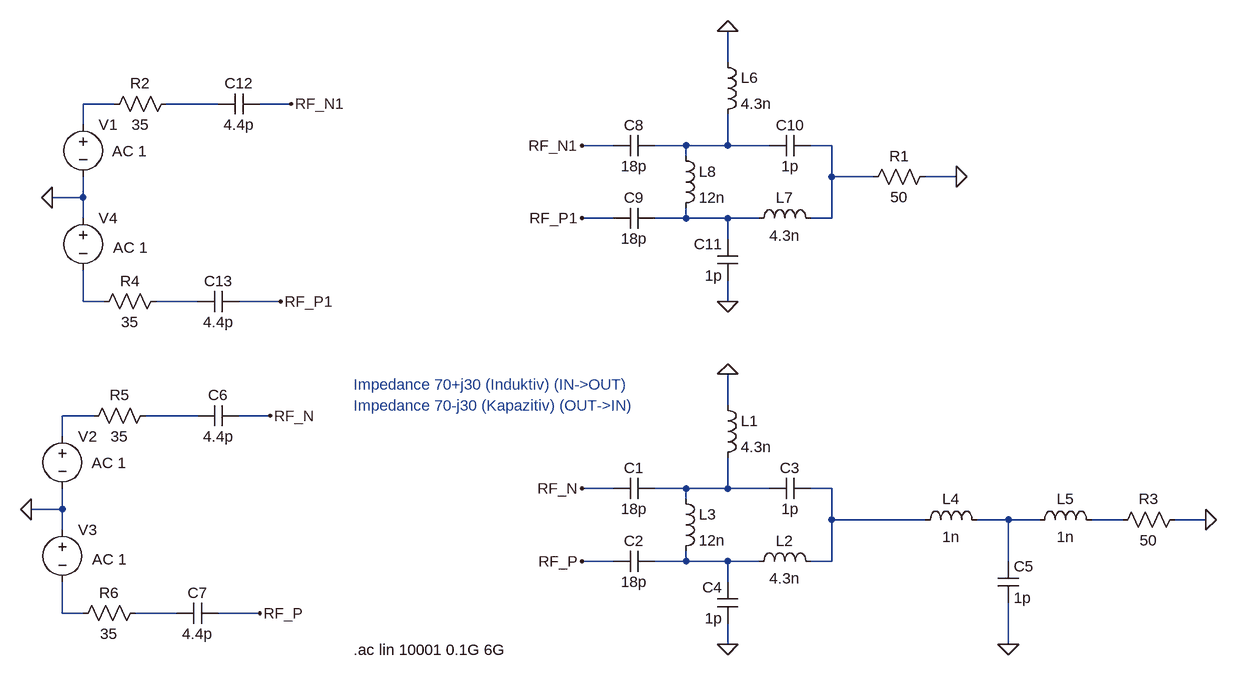
[diagram p0: schematic Antenne_2.4GHz_Serie_Gegenmessung.asc]
Antenne_2.4GHz_Serie_Gegenmessung.asc, the LTspice schematic file:
Version 4
SHEET 1 880 680
WIRE -80 -736 -80 -784
WIRE -1024 -672 -1072 -672
WIRE -864 -672 -944 -672
WIRE -752 -672 -800 -672
WIRE -1072 -640 -1072 -672
WIRE -256 -608 -304 -608
WIRE -144 -608 -192 -608
WIRE -80 -608 -80 -656
WIRE -80 -608 -144 -608
WIRE -16 -608 -80 -608
WIRE 80 -608 48 -608
WIRE -144 -592 -144 -608
WIRE 80 -560 80 -608
WIRE 144 -560 80 -560
WIRE 272 -560 224 -560
WIRE -1072 -528 -1072 -560
WIRE -1072 -528 -1120 -528
WIRE -1072 -496 -1072 -528
WIRE -256 -496 -304 -496
WIRE -144 -496 -144 -512
WIRE -144 -496 -192 -496
WIRE -80 -496 -144 -496
WIRE -32 -496 -80 -496
WIRE 80 -496 80 -560
WIRE 80 -496 48 -496
WIRE -80 -464 -80 -496
WIRE -1072 -368 -1072 -416
WIRE -1040 -368 -1072 -368
WIRE -896 -368 -960 -368
WIRE -768 -368 -832 -368
WIRE -80 -368 -80 -400
WIRE -80 -208 -80 -256
WIRE -1056 -192 -1104 -192
WIRE -896 -192 -976 -192
WIRE -784 -192 -832 -192
WIRE -1104 -160 -1104 -192
WIRE -256 -80 -304 -80
WIRE -144 -80 -192 -80
WIRE -80 -80 -80 -128
WIRE -80 -80 -144 -80
WIRE -16 -80 -80 -80
WIRE 80 -80 48 -80
WIRE -144 -64 -144 -80
WIRE -1104 -48 -1104 -80
WIRE -1104 -48 -1152 -48
WIRE 80 -32 80 -80
WIRE 224 -32 80 -32
WIRE 352 -32 304 -32
WIRE 400 -32 352 -32
WIRE 528 -32 480 -32
WIRE 656 -32 608 -32
WIRE -1104 -16 -1104 -48
WIRE -256 32 -304 32
WIRE -144 32 -144 16
WIRE -144 32 -192 32
WIRE -80 32 -144 32
WIRE -32 32 -80 32
WIRE 80 32 80 -32
WIRE 80 32 48 32
WIRE 352 32 352 -32
WIRE -80 64 -80 32
WIRE -1104 112 -1104 64
WIRE -1072 112 -1104 112
WIRE -928 112 -992 112
WIRE -800 112 -864 112
WIRE -80 160 -80 128
WIRE 352 160 352 96
FLAG -80 -256 0
FLAG -304 -80 RF_N
FLAG -304 32 RF_P
FLAG -80 160 0
FLAG -784 -192 RF_N
FLAG -800 112 RF_P
FLAG 656 -32 0
FLAG -1152 -48 0
FLAG 352 160 0
FLAG -80 -784 0
FLAG -304 -608 RF_N1
FLAG -304 -496 RF_P1
FLAG -80 -368 0
FLAG 272 -560 0
FLAG -752 -672 RF_N1
FLAG -768 -368 RF_P1
FLAG -1120 -528 0
SYMBOL cap -192 -96 R90
WINDOW 0 0 32 VBottom 2
WINDOW 3 32 32 VTop 2
SYMATTR InstName C1
SYMATTR Value 18p
SYMBOL cap -192 16 R90
WINDOW 0 0 32 VBottom 2
WINDOW 3 32 32 VTop 2
SYMATTR InstName C2
SYMATTR Value 18p
SYMBOL cap 48 -96 R90
WINDOW 0 0 32 VBottom 2
WINDOW 3 32 32 VTop 2
SYMATTR InstName C3
SYMATTR Value 1p
SYMBOL ind -96 -224 R0
SYMATTR InstName L1
SYMATTR Value 4.3n
SYMBOL ind -48 48 R270
WINDOW 0 32 56 VTop 2
WINDOW 3 5 56 VBottom 2
SYMATTR InstName L2
SYMATTR Value 4.3n
SYMBOL cap -64 128 R180
WINDOW 0 24 56 Left 2
WINDOW 3 24 8 Left 2
SYMATTR InstName C4
SYMATTR Value 1p
SYMBOL res 624 -48 R90
WINDOW 0 0 56 VBottom 2
WINDOW 3 32 56 VTop 2
SYMATTR InstName R3
SYMATTR Value 50
SYMBOL ind -160 -80 R0
SYMATTR InstName L3
SYMATTR Value 12n
SYMBOL voltage -1104 -176 R0
WINDOW 123 45 57 Left 2
WINDOW 39 0 0 Left 2
SYMATTR Value2 AC 1
SYMATTR InstName V2
SYMATTR Value ""
SYMBOL voltage -1104 -32 R0
WINDOW 123 46 61 Left 2
WINDOW 39 0 0 Left 2
SYMATTR Value2 AC 1
SYMATTR InstName V3
SYMATTR Value ""
SYMBOL res -960 -208 R90
WINDOW 0 0 56 VBottom 2
WINDOW 3 32 56 VTop 2
SYMATTR InstName R5
SYMATTR Value 35
SYMBOL res -976 96 R90
WINDOW 0 0 56 VBottom 2
WINDOW 3 32 56 VTop 2
SYMATTR InstName R6
SYMATTR Value 35
SYMBOL ind 208 -16 R270
WINDOW 0 32 56 VTop 2
WINDOW 3 5 56 VBottom 2
SYMATTR InstName L4
SYMATTR Value 1n
SYMBOL cap 336 32 R0
SYMATTR InstName C5
SYMATTR Value 1p
SYMBOL ind 384 -16 R270
WINDOW 0 32 56 VTop 2
WINDOW 3 5 56 VBottom 2
SYMATTR InstName L5
SYMATTR Value 1n
SYMBOL cap -832 -208 R90
WINDOW 0 0 32 VBottom 2
WINDOW 3 32 32 VTop 2
SYMATTR InstName C6
SYMATTR Value 4.4p
SYMBOL cap -864 96 R90
WINDOW 0 0 32 VBottom 2
WINDOW 3 32 32 VTop 2
SYMATTR InstName C7
SYMATTR Value 4.4p
SYMBOL cap -192 -624 R90
WINDOW 0 0 32 VBottom 2
WINDOW 3 32 32 VTop 2
SYMATTR InstName C8
SYMATTR Value 18p
SYMBOL cap -192 -512 R90
WINDOW 0 0 32 VBottom 2
WINDOW 3 32 32 VTop 2
SYMATTR InstName C9
SYMATTR Value 18p
SYMBOL cap 48 -624 R90
WINDOW 0 0 32 VBottom 2
WINDOW 3 32 32 VTop 2
SYMATTR InstName C10
SYMATTR Value 1p
SYMBOL ind -96 -752 R0
SYMATTR InstName L6
SYMATTR Value 4.3n
SYMBOL ind -48 -480 R270
WINDOW 0 32 56 VTop 2
WINDOW 3 5 56 VBottom 2
SYMATTR InstName L7
SYMATTR Value 4.3n
SYMBOL cap -64 -400 R180
WINDOW 0 24 56 Left 2
WINDOW 3 24 8 Left 2
SYMATTR InstName C11
SYMATTR Value 1p
SYMBOL ind -160 -608 R0
SYMATTR InstName L8
SYMATTR Value 12n
SYMBOL res 240 -576 R90
WINDOW 0 0 56 VBottom 2
WINDOW 3 32 56 VTop 2
SYMATTR InstName R1
SYMATTR Value 50
SYMBOL voltage -1072 -656 R0
WINDOW 123 45 57 Left 2
WINDOW 39 0 0 Left 2
SYMATTR Value2 AC 1
SYMATTR InstName V1
SYMATTR Value ""
SYMBOL voltage -1072 -512 R0
WINDOW 123 46 61 Left 2
WINDOW 39 0 0 Left 2
SYMATTR Value2 AC 1
SYMATTR InstName V4
SYMATTR Value ""
SYMBOL res -928 -688 R90
WINDOW 0 0 56 VBottom 2
WINDOW 3 32 56 VTop 2
SYMATTR InstName R2
SYMATTR Value 35
SYMBOL res -944 -384 R90
WINDOW 0 0 56 VBottom 2
WINDOW 3 32 56 VTop 2
SYMATTR InstName R4
SYMATTR Value 35
SYMBOL cap -800 -688 R90
WINDOW 0 0 32 VBottom 2
WINDOW 3 32 32 VTop 2
SYMATTR InstName C12
SYMATTR Value 4.4p
SYMBOL cap -832 -384 R90
WINDOW 0 0 32 VBottom 2
WINDOW 3 32 32 VTop 2
SYMATTR InstName C13
SYMATTR Value 4.4p
TEXT -656 168 Left 2 !.ac lin 10001 0.1G 6G
TEXT -656 -240 Left 2 ;Impedance 70+j30 (Induktiv) (IN->OUT)
TEXT -656 -208 Left 2 ;Impedance 70-j30 (Kapazitiv) (OUT->IN)

The netlist it stands for:
* Antenne_2.4GHz_Serie_Gegenmessung.asc
C1 N010 RF_N 18p
C2 N014 RF_P 18p
C3 N011 N010 1p
L1 0 N010 4.3n
L2 N014 N011 4.3n
C4 0 N014 1p
R3 0 N013 50
L3 N010 N014 12n
V2 N008 0 AC 1
V3 0 N015 AC 1
R5 N009 N008 35
R6 N016 N015 35
L4 N011 N012 1n
C5 N012 0 1p
L5 N012 N013 1n
C6 RF_N N009 4.4p
C7 RF_P N016 4.4p
C8 N003 RF_N1 18p
C9 N005 RF_P1 18p
C10 N004 N003 1p
L6 0 N003 4.3n
L7 N005 N004 4.3n
C11 0 N005 1p
L8 N003 N005 12n
R1 0 N004 50
V1 N001 0 AC 1
V4 0 N006 AC 1
R2 N002 N001 35
R4 N007 N006 35
C12 RF_N1 N002 4.4p
C13 RF_P1 N007 4.4p
.ac lin 10001 0.1G 6G
* Impedance 70+j30 (Induktiv) (IN->OUT)
* Impedance 70-j30 (Kapazitiv) (OUT->IN)
.backanno
.end